# EAGLE schematic x9303 (EAGLE 9.6.2)

## Sheet 1 of 3
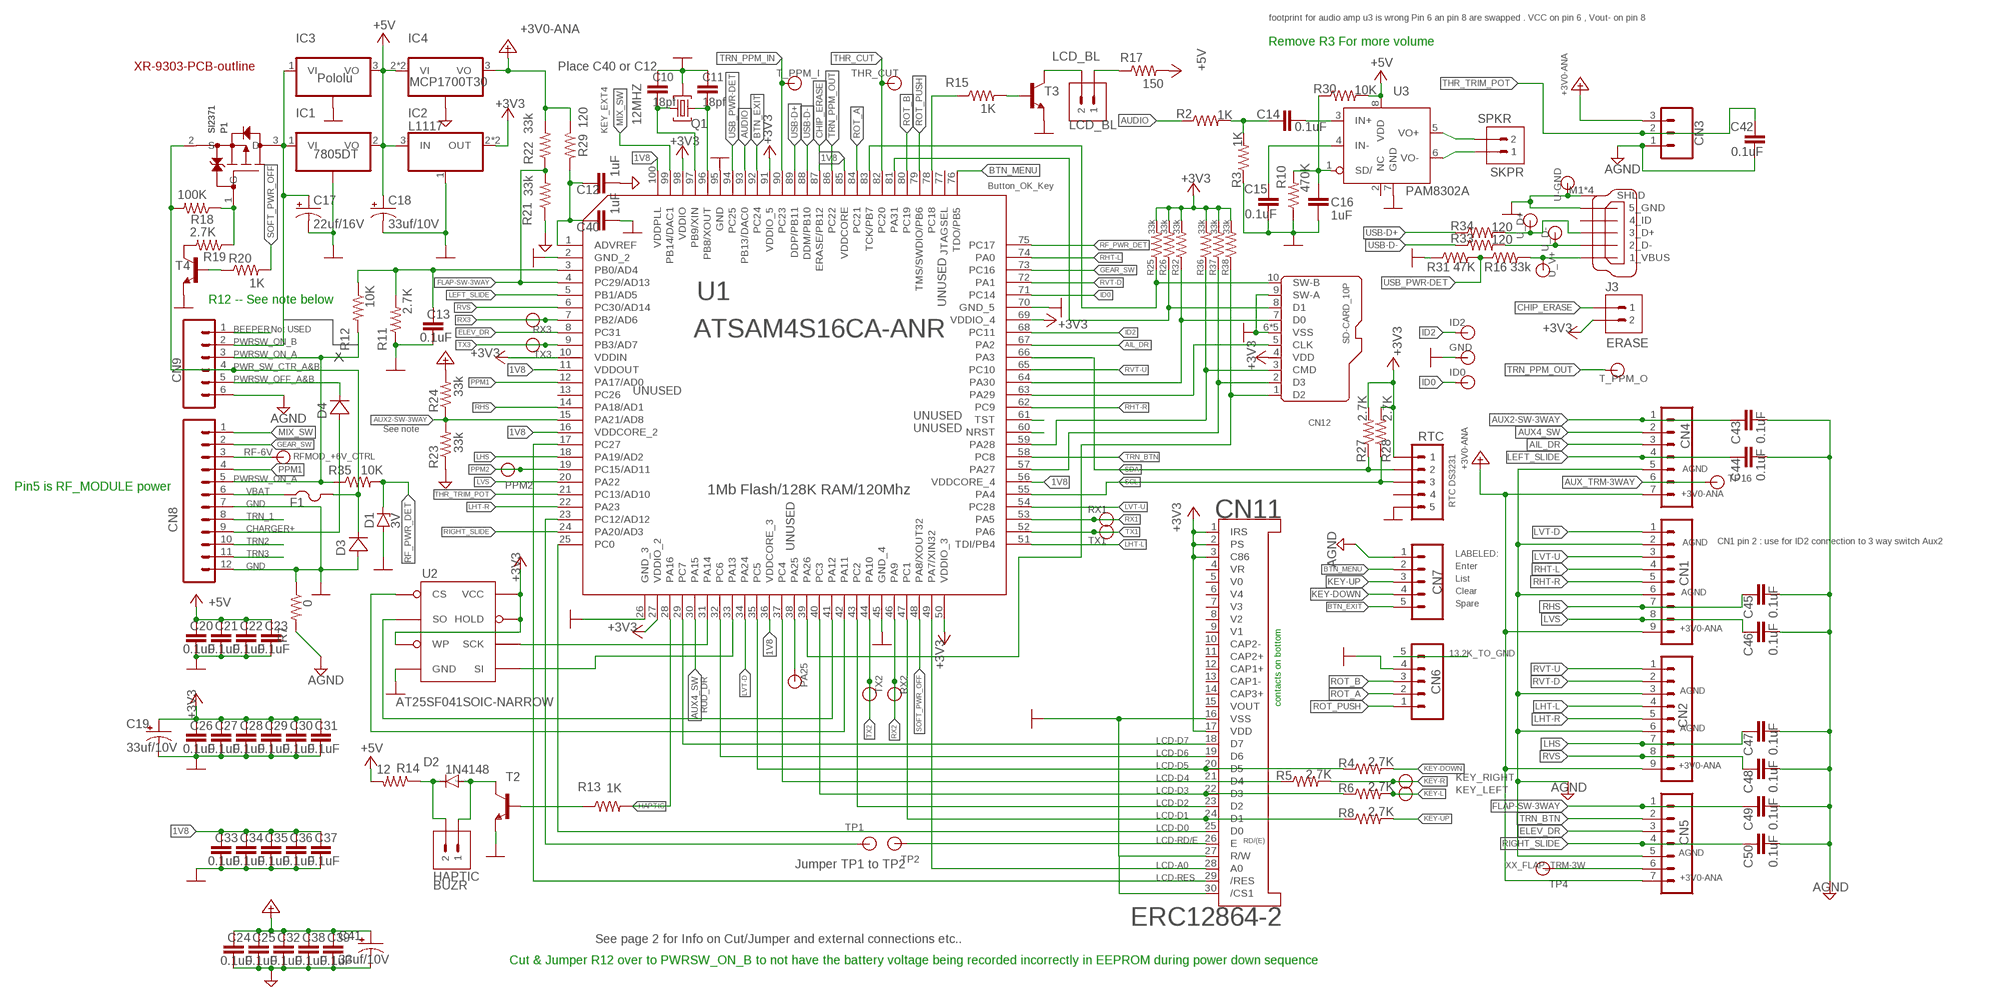
[diagram p0: schematic, sheet 1]

### Parts
BUZR  HAPTIC  M02  [1X02]
C10  18pf  C-EUC0603K  [C0603K]
C11  18pf  C-EUC0603K  [C0603K]
C12  1uF  C-EUC0603K  [C0603K]
C13  0.1uF  C-EUC0603K  [C0603K]
C14  0.1uF  C-EUC0603K  [C0603K]
C15  0.1uF  C-EUC0603K  [C0603K]
C16  1uF  C-EUC0603K  [C0603K]
C17  22uf/16V  CPOL-USSMCB  [SMC_B]
C18  33uf/10V  CPOL-USSMCB  [SMC_B]
C19  33uf/10V  CPOL-USSMCB  [SMC_B]
C20  0.1uF  C-EUC0603K  [C0603K]
C21  0.1uF  C-EUC0603K  [C0603K]
C22  0.1uF  C-EUC0603K  [C0603K]
C23  0.1uF  C-EUC0603K  [C0603K]
C24  0.1uF  C-EUC0603K  [C0603K]
C25  0.1uF  C-EUC0603K  [C0603K]
C26  0.1uF  C-EUC0603K  [C0603K]
C27  0.1uF  C-EUC0603K  [C0603K]
C28  0.1uF  C-EUC0603K  [C0603K]
C29  0.1uF  C-EUC0603K  [C0603K]
C30  0.1uF  C-EUC0603K  [C0603K]
C31  0.1uF  C-EUC0603K  [C0603K]
C32  0.1uF  C-EUC0603K  [C0603K]
C33  0.1uF  C-EUC0603K  [C0603K]
C34  0.1uF  C-EUC0603K  [C0603K]
C35  0.1uF  C-EUC0603K  [C0603K]
C36  0.1uF  C-EUC0603K  [C0603K]
C37  0.1uF  C-EUC0603K  [C0603K]
C38  0.1uF  C-EUC0603K  [C0603K]
C39  0.1uF  C-EUC0603K  [C0603K]
C40  1uF  C-EUC0603K  [C0603K]
C41  33uf/10V  CPOL-USSMCB  [SMC_B]
C42  0.1uF  C-EUC0603K  [C0603K]
C43  0.1uF  C-EUC0603K  [C0603K]
C44  0.1uF  C-EUC0603K  [C0603K]
C45  0.1uF  C-EUC0603K  [C0603K]
C46  0.1uF  C-EUC0603K  [C0603K]
C47  0.1uF  C-EUC0603K  [C0603K]
C48  0.1uF  C-EUC0603K  [C0603K]
C49  0.1uF  C-EUC0603K  [C0603K]
C50  0.1uF  C-EUC0603K  [C0603K]
CN1  CONN_09JST-9-PTH-V  [JST-9-PTH-VERT]
CN2  CONN_09JST-9-PTH-V  [JST-9-PTH-VERT]
CN3  CONN_03JST-PTH-VERT  [JST-3-PTH-VERT]
CN4  CONN_07JST-7PTH-V  [JST-7-PTH-VERT]
CN5  CONN_07JST-7PTH-V  [JST-7-PTH-VERT]
CN6  CONN_05JST-VERT  [JST-5-PTH-VERT]
CN7  CONN_05JST-VERT  [JST-5-PTH-VERT]
CN8  CONN_12JST-12-PTH-V  [JST-12-PTH-VERT]
CN9  CONN_06JST-6-PTH-V  [JST-6-PTH-VERT]
CN11  ERC12864-2  FPC_30_ERC12864-2  [FH12-30S-0.5SH]
CN12  SD-CARD_10P  [CONN8_DM3D-SF_HIR]
D1  3V  ZENER-DIODESOT23  [SOT23]
D2  1N4148  1N4148DO35-7  [DO35-7]
D3  MURA220T3G  [SMA]
D4  MURA220T3G  [SMA]
F1  SMD-FUSE-1206  [R1206]
GND  TP-1  [TP]
IC1  7805DT  [TO252]
IC2  L1117  REG1117  [SOT223]
IC3  Pololu  78  [POLOLU]
IC4  MCP1700T30  MCP1700  [SOT89]
ID0  TP-1  [TP]
ID2  TP-1  [TP]
J3  ERASE  M02  [1X02]
KEY_LEFT  TP-1  [TP]
KEY_RIGHT  TP-1  [TP]
LCD_BL  LCD_BL  M02  [1X02]
P1  SI2371  [SOT23]
PA25  TP-1  [TP]
PPM2  TP-1  [TP]
Q1  12MHZ  XTAL_SMD  [XTAL2.4X2.7]
R2  1K  R-US_R0603  [R0603]
R3  1K  R-US_R0603  [R0603]
R4  2.7K  R-US_R0603  [R0603]
R5  2.7K  R-US_R0603  [R0603]
R6  2.7K  R-US_R0603  [R0603]
R7  0  R-US_R0805  [R0805]
R8  2.7K  R-US_R0603  [R0603]
R10  470K  R-US_R0603  [R0603]
R11  2.7K  R-US_R0603  [R0603]
R12  10K  R-US_R0603  [R0603]
R13  1K  R-US_R0603  [R0603]
R14  12  R-US_R0805  [R0805]
R15  1K  R-US_R0603  [R0603]
R16  33k  R-US_R0603  [R0603]
R17  150  R-US_R0805  [R0805]
R18  100K  R-US_R0603  [R0603]
R19  2.7K  R-US_R0603  [R0603]
R20  1K  R-US_R0603  [R0603]
R21  33k  R-US_R0603  [R0603]
R22  33k  R-US_R0603  [R0603]
R23  33k  R-US_R0603  [R0603]
R24  33k  R-US_R0603  [R0603]
R25  33k  R-US_R0603  [R0603]
R26  33k  R-US_R0603  [R0603]
R27  2.7K  R-US_R0603  [R0603]
R28  2.7K  R-US_R0603  [R0603]
R29  120  R-US_R0603  [R0603]
R30  10K  R-US_R0603  [R0603]
R31  47K  R-US_R0603  [R0603]
R32  33k  R-US_R0603  [R0603]
R33  120  R-US_R0603  [R0603]
R34  120  R-US_R0603  [R0603]
R35  10K  R-US_R0603  [R0603]
R36  33k  R-US_R0603  [R0603]
R37  33k  R-US_R0603  [R0603]
R38  33k  R-US_R0603  [R0603]
RF-6V  TP-1  [TP]
RTC  M05PTH  [1X05]
RX1  TP-1  [TP]
RX2  TP-1  [TP]
RX3  TP-1  [TP]
SPKR  SKPR  M02  [1X02]
T2  MMBT3904  MMBT3904LT1-NPN-SOT23-BEC  [SOT23-BEC]
T3  MMBT3904  MMBT3904LT1-NPN-SOT23-BEC  [SOT23-BEC]
T4  MMBT3904  MMBT3904LT1-NPN-SOT23-BEC  [SOT23-BEC]
T_PPM_I  TP-1  [TP]
T_PPM_O  TP-1  [TP]
THR_CUT  TP-1  [TP]
TP1  TP-1  [TP]
TP2  TP-1  [TP]
TP4  TP-1  [TP]
TP16  TP-1  [TP]
TX1  TP-1  [TP]
TX2  TP-1  [TP]
TX3  TP-1  [TP]
U1  ATSAM4S16CA-ANR  [TQFP100_14X14MC_MCH]
U2  AT25SF041SOIC-NARROW  AT25F041SOIC-NARROW  [SO08]
U3  PAM8302A  [SOIC_2AADCR_DIO]
U$1  XR9303-PCB  [XR9303-PCB_OUTLINE]
U-GND  TP-1  [TP]
U_D+  TP-1  [TP]
U_D-  TP-1  [TP]
U_V+  TP-1  [TP]
X2  MINI-USB-32005-201  [32005-201]

### Nets
1V8: C33.2 C34.2 C35.2 C36.2 C37.2 U1.11(VDDOUT) U1.16(VDDCORE_2) U1.36(VDDCORE_3) U1.56(VDDCORE_4) U1.85(VDDCORE) U1.100(VDDPLL)
13.2K_TO_GND: CN6.5
+3V0-ANA: C24.2 C25.2 C32.2 C38.2 C39.2 C41.+ CN1.9 CN2.9 CN3.3 CN4.7 CN5.7 IC4.3(VO) R22.2 R24.2 R29.1
+3V3: C19.+ C26.2 C27.2 C28.2 C29.2 C30.2 C31.2 CN11.1(IRS) CN11.2(PS) CN11.3(C86) CN11.17(VDD) CN12.4(VDD) IC2.2(OUT) IC2.4(OUT) J3.2 R25.2 R26.2 R27.2 R28.2 R32.2 R36.2 R37.2 R38.2 RTC.1 U1.10(VDDIN) U1.27(VDDIO_2) U1.50(VDDIO_3) U1.69(VDDIO_4) U1.91(VDDIO_5) U1.98(VDDIO) U2.3(WP) U2.7(HOLD) U2.8(VCC)
+5V: C18.+ C20.2 C21.2 C22.2 C23.2 IC1.2(VO) IC2.3(IN) IC3.3(VO) IC4.2(VI) IC4.4(VI) R14.2 R17.2 R30.2 U3.8(VDD)
AGND: C12.2 C24.1 C25.1 C32.1 C38.1 C39.1 C41.- C42.1 C43.1 C44.1 C45.1 C46.1 C47.1 C48.1 C49.1 C50.1 CN1.2 CN1.6 CN2.3 CN2.6 CN3.1 CN4.5 CN5.5 CN7.1 CN9.6 IC4.1(GND) R7.2 R21.1 R23.1
AIL_DR: CN4.3 U1.67(PA2)
AUDIO: R2.1 U1.93(PB13/DAC0)
AUX2-SW-3WAY: C43.2 CN4.1 R23.2 R24.1 U1.15(PA21/AD8)
AUX4_SW: CN4.2 U1.30(PA15)
AUX_TRM-3WAY: CN4.6 TP16.P$1
BEEPER: CN9.1
BTN_EXIT: CN7.5 U1.92(PC24)
BTN_MENU: CN7.2 U1.76(TDO/PB5)
CHARGER+: CN8.9 D4.A
CHIP_ERASE: J3.1 U1.87(ERASE/PB12)
ELEV_DR: CN5.3 U1.8(PC31)
FLAP-SW-3WAY: C49.2 CN5.1 R21.2 R22.1 U1.4(PC29/AD13)
FLASH_CS: U1.42(PA11) U2.1(CS)
GEAR_SW: CN8.2 U1.73(PC16)
GND: C10.1 C11.1 C13.1 C15.1 C16.2 C17.- C18.- C19.- C20.1 C21.1 C22.1 C23.1 C26.1 C27.1 C28.1 C29.1 C30.1 C31.1 C33.1 C34.1 C35.1 C36.1 C37.1 C40.2 CN6.4 CN8.7 CN8.12 CN11.16(VSS) CN11.27(R/W) CN11.30(/CS1) CN12.6(VSS) CN12.9(SW-A) CN12.GND1(VSS) CN12.GND2(VSS) CN12.GND3(VSS) CN12.GND4(VSS) D1.1(A) D3.A GND.P$1 IC1.3(GND) IC2.1(GND) IC3.2(GND) Q1.P$2 Q1.P$4 R3.1 R7.1 R10.1 R11.1 R31.1 RTC.5 T2.E T3.E T4.E U1.2(GND_2) U1.26(GND_3) U1.45(GND_4) U1.70(GND_5) U1.95(GND) U2.4(GND) U3.7(GND) U-GND.P$1 X2.5_USB_GND(5_GND) X2.M1(SHLD) X2.M2(SHLD) X2.M3(SHLD) X2.M4(SHLD)
HAPTIC: R13.2 U1.28(PA16)
ID0: ID0.P$1 U1.71(PC14)
ID2: ID2.P$1 U1.68(PC11)
KEY-DOWN: CN7.4 R4.2
KEY-L: KEY_LEFT.P$1 R6.2
KEY-R: KEY_RIGHT.P$1 R5.2
KEY-UP: CN7.3 R8.2
LCD-A0: CN11.28(A0) U1.49(PA7/XIN32)
LCD-D0: CN11.25(D0) U1.25(PC0)
LCD-D1: CN11.24(D1) R8.1 U1.47(PC1)
LCD-D2: CN11.23(D2) U1.43(PC2)
LCD-D3: CN11.22(D3) R6.1 U1.40(PC3)
LCD-D4: CN11.21(D4) R5.1 U1.37(PC4)
LCD-D5: CN11.20(D5) R4.1 U1.35(PC5)
LCD-D6: CN11.19(D6) U1.32(PC6)
LCD-D7: CN11.18(D7) U1.29(PC7)
LCD-RD/E: CN11.26(E) TP2.P$1
LCD-RES: CN11.29(/RES) U1.17(PC27)
LCD_BL: R15.1 U1.78(PC18)
LEFT_SLIDE: C44.2 CN4.4 U1.5(PB1/AD5)
LHS: C47.2 CN2.7 U1.18(PA19/AD2)
LHT-L: CN2.4 U1.51(TDI/PB4)
LHT-R: CN2.5 U1.22(PA23)
LVS: C46.2 CN1.8 U1.20(PA22)
LVT-D: CN1.1 U1.34(PA24)
LVT-U: CN1.3 U1.54(PC28)
MIX_SW: CN8.1 U1.99(PB14/DAC1)
N$1: C16.1 R10.2 R30.1 U3.1(SD/)
N$2: R16.2 U_V+.P$1 X2.1_VBUS
N$13: P1.1(G) R18.1 R19.1
N$16: R19.2 T4.C
N$17: R34.2 U_D+.P$1 X2.3_D+
N$18: C14.1 R2.2 R3.2
N$19: R20.1 T4.B
N$20: BUZR.2 D2.C R14.1
N$22: TP1.P$1 U1.23(PC12/AD12)
N$23: U1.31(PA14) U2.6(SCK)
N$24: U1.33(PA13) U2.5(SI)
N$25: PA25.P$1 U1.38(PA25)
N$26: U1.41(PA12) U2.2(SO)
N$30: C10.2 Q1.P$3 U1.97(PB9/XIN)
N$31: C11.2 Q1.P$1 U1.96(PB8/XOUT)
N$34: CN12.8(D1) R26.1 U1.81(PA31)
N$35: CN12.10(SW-B) R25.1 U1.83(TCK/PB7)
N$36: CN12.7(D0) R32.1 U1.64(PA30)
N$37: CN12.5(CLK) U1.63(PA29)
N$38: R13.1 T2.B
N$40: CN12.2(D3) R37.1 U1.57(PA27)
N$41: CN12.1(D2) R38.1 U1.39(PA26)
N$42: SPKR.2 U3.5(VO+)
N$43: BUZR.1 D2.A T2.C
N$45: R15.2 T3.B
N$46: LCD_BL.2 T3.C
N$47: LCD_BL.1 R17.1
N$54: U1.61(TST)
N$55: U1.60(NRST)
N$57: C12.1 C40.1 R29.2 U1.1(ADVREF)
N$58: CN12.3(CMD) R36.1 U1.59(PA28)
N$59: SPKR.1 U3.6(VO-)
N$61: C14.2 U3.3(IN+)
N$62: C15.2 U3.4(IN-)
PPM1: CN8.4 U1.12(PA17/AD0)
PPM2: PPM2.P$1 U1.19(PC15/AD11)
PWR_SW_CTR_A&B: CN9.4 D3.C F1.2 P1.2(S) R18.2
PWRSW_OFF_A&B: CN9.5 D4.C
PWRSW_ON_A: CN8.5 CN9.3 R12.2 R35.1
PWRSW_ON_B: C17.+ CN9.2 IC1.1(VI) IC3.1(VI) P1.3(D)
RF_PWR_DET: D1.3(C) R35.2 U1.75(PC17)
RFMOD_+6V_CTRL: CN8.3 RF-6V.P$1
RHS: C45.2 CN1.7 U1.14(PA18/AD1)
RHT-L: CN1.4 U1.74(PA0)
RHT-R: CN1.5 U1.62(PC9)
RIGHT_SLIDE: C50.2 CN5.4 U1.24(PA20/AD3)
ROT_A: CN6.2 U1.84(PC21)
ROT_B: CN6.3 U1.80(PC19)
ROT_PUSH: CN6.1 U1.79(TMS/SWDIO/PB6)
RVS: C48.2 CN2.8 U1.6(PC30/AD14)
RVT-D: CN2.2 U1.72(PA1)
RVT-U: CN2.1 U1.65(PC10)
RX1: RX1.P$1 U1.53(PA5)
RX2: RX2.P$1 U1.46(PA9)
RX3: RX3.P$1 U1.7(PB2/AD6)
SCL: R28.1 RTC.3 U1.55(PA4)
SDA: R27.1 RTC.2 U1.66(PA3)
SOFT_PWR_OFF: R20.2 U1.48(PA8/XOUT32)
THR_CUT: THR_CUT.P$1 U1.82(PC20)
THR_TRIM_POT: C42.2 CN3.2 U1.21(PC13/AD10)
TRN2: CN8.10
TRN3: CN8.11
TRN_1: CN8.8
TRN_BTN: CN5.2 U1.58(PC8)
TRN_PPM_IN: T_PPM_I.P$1 U1.90(PC23)
TRN_PPM_OUT: T_PPM_O.P$1 U1.86(PC22)
TX1: TX1.P$1 U1.52(PA6)
TX2: TX2.P$1 U1.44(PA10)
TX3: TX3.P$1 U1.9(PB3/AD7)
USB-D+: R34.1 U1.89(DDP/PB11)
USB-D-: R33.1 U1.88(DDM/PB10)
USB_D-: R33.2 U_D-.P$1 X2.2_D-
USB_PWR-DET: R16.1 R31.2 U1.94(PC25)
VBAT: CN8.6 F1.1
VBAT_MEAS: C13.2 R11.2 R12.1 U1.3(PB0/AD4)
XX_FLAP_TRM-3W: CN5.6 TP4.P$1
Unconnected: CN11.4(VR) CN11.5(V0) CN11.6(V4) CN11.7(V3) CN11.8(V2) CN11.9(V1) CN11.10(CAP2-) CN11.11(CAP2+) CN11.12(CAP1+) CN11.13(CAP1-) CN11.14(CAP3+) CN11.15(VOUT) RTC.4 U1.13(PC26) U1.77(JTAGSEL) U3.2(NC) X2.4_ID

### Notes on the sheet
- footprint for audio amp u3 is wrong Pin 6 an pin 8 are swapped . VCC on pin 6 , Vout- on pin 8
- Remove R3 For more volume
- Place C40 or C12
- KEY_EXT4
- Button_OK_Key
- UNUSED
- R12 -- See note below
- Not USED
- PWRSW_ON_A
- UNUSED
- UNUSED
- See note | UNUSED
- Pin5 is RF_MODULE power
- 1Mb Flash/128K RAM/120Mhz
- RTC DS3231
- CN1 pin 2 : use for ID2 connection to 3 way switch Aux2
- UNUSED
- LABELED:
- Enter
- List
- Clear
- Spare
- contacts on bottom
- RUD_DR
- RD/(E)
- Jumper TP1 to TP2
- See page 2 for Info on Cut/Jumper and external connections etc..
- Cut & Jumper R12 over to PWRSW_ON_B to not have the battery voltage being recorded incorrectly in EEPROM during power down sequence

## Sheet 2 of 3
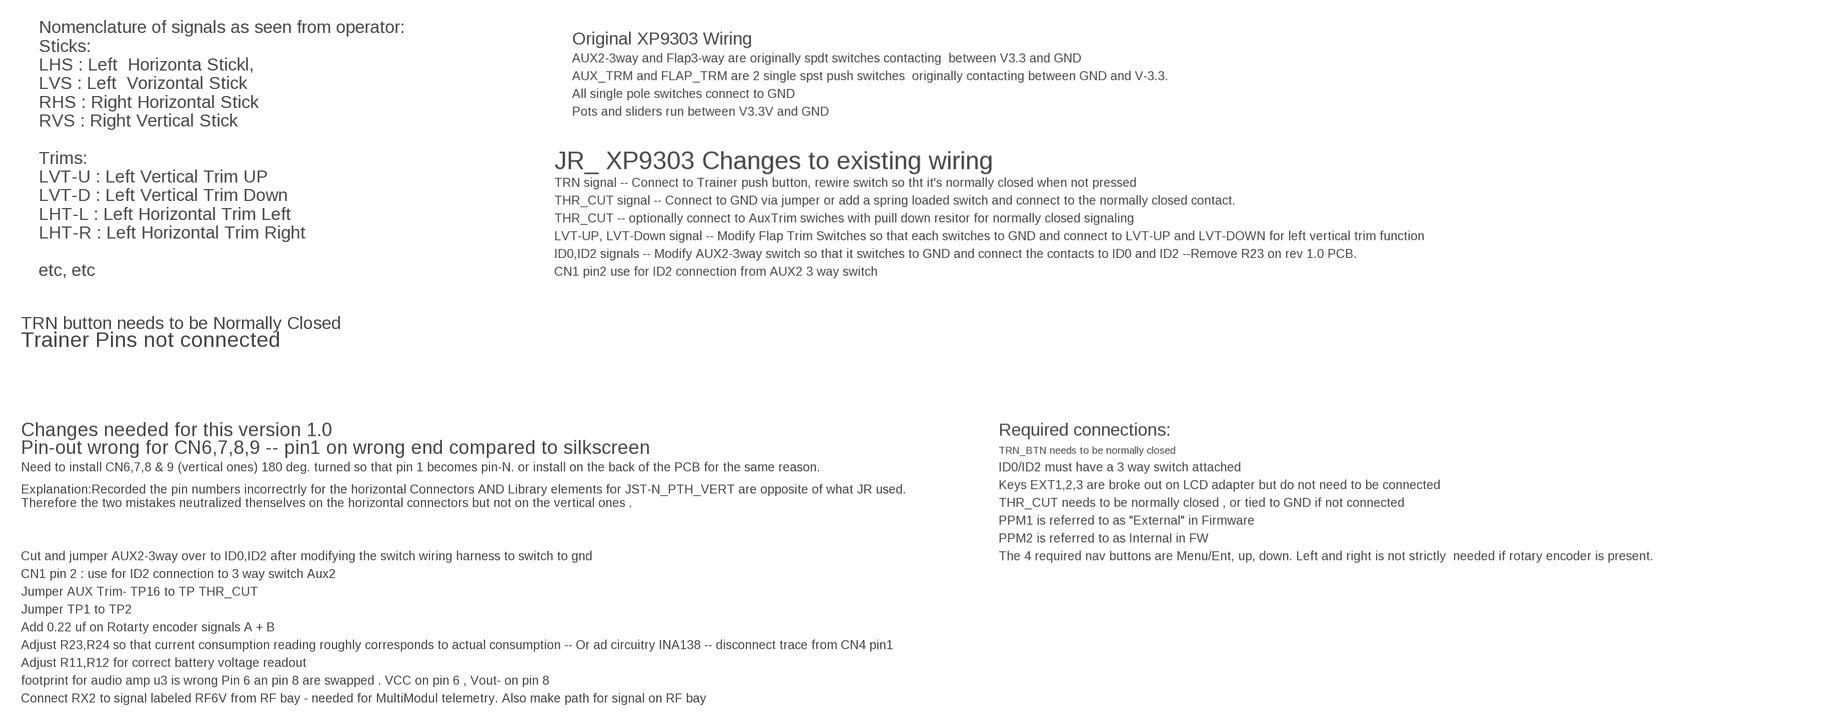
[diagram p1: schematic, sheet 2]

### Notes on the sheet
- Original XP9303 Wiring
- AUX2-3way and Flap3-way are originally spdt switches contacting  between V3.3 and GND
- AUX_TRM and FLAP_TRM are 2 single spst push switches  originally contacting between GND and V-3.3.
- All single pole switches connect to GND
- Pots and sliders run between V3.3V and GND
- JR_ XP9303 Changes to existing wiring
- TRN signal -- Connect to Trainer push button, rewire switch so tht it's normally closed when not pressed
- THR_CUT signal -- Connect to GND via jumper or add a spring loaded switch and connect to the normally closed contact.
- THR_CUT -- optionally connect to AuxTrim swiches with puill down resitor for normally closed signaling
- LVT-UP, LVT-Down signal -- Modify Flap Trim Switches so that each switches to GND and connect to LVT-UP and LVT-DOWN for left vertical trim function
- ID0,ID2 signals -- Modify AUX2-3way switch so that it switches to GND and connect the contacts to ID0 and ID2 --Remove R23 on rev 1.0 PCB.
- Nomenclature of signals as seen from operator:
  Sticks:
  LHS : Left  Horizonta Stickl,
  LVS : Left  Vorizontal Stick
  RHS : Right Horizontal Stick
  RVS : Right Vertical Stick
  
  Trims:
  LVT-U : Left Vertical Trim UP
  LVT-D : Left Vertical Trim Down
  LHT-L : Left Horizontal Trim Left
  LHT-R : Left Horizontal Trim Right
  
  etc, etc
- CN1 pin2 use for ID2 connection from AUX2 3 way switch
- TRN button needs to be Normally Closed
- Trainer Pins not connected
- Changes needed for this version 1.0 | Required connections:
- Pin-out wrong for CN6,7,8,9 -- pin1 on wrong end compared to silkscreen | TRN_BTN needs to be normally closed
- Need to install CN6,7,8 & 9 (vertical ones) 180 deg. turned so that pin 1 becomes pin-N. or install on the back of the PCB for the same reason. | ID0/ID2 must have a 3 way switch attached
- Keys EXT1,2,3 are broke out on LCD adapter but do not need to be connected
- Explanation:Recorded the pin numbers incorrectrly for the horizontal Connectors AND Library elements for JST-N_PTH_VERT are opposite of what JR used. 
  Therefore the two mistakes neutralized thenselves on the horizontal connectors but not on the vertical ones .
- THR_CUT needs to be normally closed , or tied to GND if not connected
- PPM1 is referred to as "External" in Firmware
- PPM2 is referred to as Internal in FW
- Cut and jumper AUX2-3way over to ID0,ID2 after modifying the switch wiring harness to switch to gnd | The 4 required nav buttons are Menu/Ent, up, down. Left and right is not strictly  needed if rotary encoder is present.
- CN1 pin 2 : use for ID2 connection to 3 way switch Aux2
- Jumper AUX Trim- TP16 to TP THR_CUT
- Jumper TP1 to TP2
- Add 0.22 uf on Rotarty encoder signals A + B
- Adjust R23,R24 so that current consumption reading roughly corresponds to actual consumption -- Or ad circuitry INA138 -- disconnect trace from CN4 pin1
- Adjust R11,R12 for correct battery voltage readout
- footprint for audio amp u3 is wrong Pin 6 an pin 8 are swapped . VCC on pin 6 , Vout- on pin 8
- Connect RX2 to signal labeled RF6V from RF bay - needed for MultiModul telemetry. Also make path for signal on RF bay

## Sheet 3 of 3
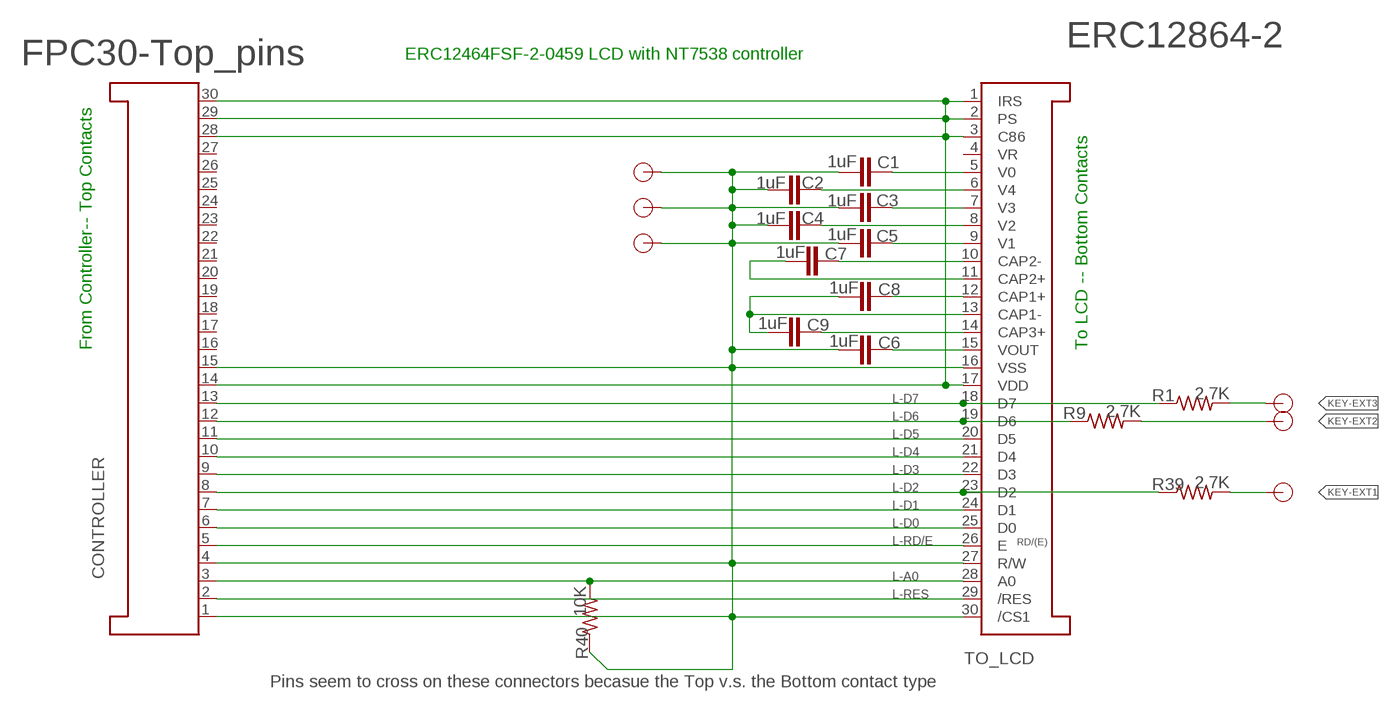
[diagram p2: schematic, sheet 3]

### Parts
C1  1uF  C-EUC0805  [C0805]
C2  1uF  C-EUC0805  [C0805]
C3  1uF  C-EUC0805  [C0805]
C4  1uF  C-EUC0805  [C0805]
C5  1uF  C-EUC0805  [C0805]
C6  1uF  C-EUC0805  [C0805]
C7  1uF  C-EUC0805  [C0805]
C8  1uF  C-EUC0805  [C0805]
C9  1uF  C-EUC0805  [C0805]
CONTROLLER  FPC30-Top_pins  FPC_30-PINS  [FH12-30S-0.5SH]
K1  TP-1  [TP]
K2  TP-1  [TP]
K3  TP-1  [TP]
K_EXT4  TP-1  [TP]
K_EXT5  TP-1  [TP]
K_EXT6  TP-1  [TP]
R1  2.7K  R-US_R0603  [R0603]
R9  2.7K  R-US_R0603  [R0603]
R39  2.7K  R-US_R0603  [R0603]
R40  10K  R-US_R0603  [R0603]
TO_LCD  ERC12864-2  FPC_30_ERC12864-2  [FH12-30S-0.5SH]

### Nets
KEY-EXT1: K1.P$1 R39.2
KEY-EXT2: K2.P$1 R9.2
KEY-EXT3: K3.P$1 R1.2
L-A0: CONTROLLER.3 R40.2 TO_LCD.28(A0)
L-D0: CONTROLLER.6 TO_LCD.25(D0)
L-D1: CONTROLLER.7 TO_LCD.24(D1)
L-D2: CONTROLLER.8 R39.1 TO_LCD.23(D2)
L-D3: CONTROLLER.9 TO_LCD.22(D3)
L-D4: CONTROLLER.10 TO_LCD.21(D4)
L-D5: CONTROLLER.11 TO_LCD.20(D5)
L-D6: CONTROLLER.12 R9.1 TO_LCD.19(D6)
L-D7: CONTROLLER.13 R1.1 TO_LCD.18(D7)
L-RD/E: CONTROLLER.5 TO_LCD.26(E)
L-RES: CONTROLLER.2 TO_LCD.29(/RES)
L_GND: C1.2 C2.2 C3.2 C4.2 C5.2 C6.2 CONTROLLER.1 CONTROLLER.4 CONTROLLER.15 K_EXT4.P$1 K_EXT5.P$1 K_EXT6.P$1 R40.1 TO_LCD.16(VSS) TO_LCD.27(R/W) TO_LCD.30(/CS1)
L_VDD: CONTROLLER.14 CONTROLLER.28 CONTROLLER.29 CONTROLLER.30 TO_LCD.1(IRS) TO_LCD.2(PS) TO_LCD.3(C86) TO_LCD.17(VDD)
N$3: C1.1 TO_LCD.5(V0)
N$4: C2.1 TO_LCD.6(V4)
N$5: C3.1 TO_LCD.7(V3)
N$6: C4.1 TO_LCD.8(V2)
N$7: C5.1 TO_LCD.9(V1)
N$9: C7.1 TO_LCD.10(CAP2-)
N$10: C7.2 TO_LCD.11(CAP2+)
N$11: C8.2 C9.2 TO_LCD.13(CAP1-)
N$12: C8.1 TO_LCD.12(CAP1+)
N$14: C9.1 TO_LCD.14(CAP3+)
N$15: C6.1 TO_LCD.15(VOUT)
Unconnected: CONTROLLER.16 CONTROLLER.17 CONTROLLER.18 CONTROLLER.19 CONTROLLER.20 CONTROLLER.21 CONTROLLER.22 CONTROLLER.23 CONTROLLER.24 CONTROLLER.25 CONTROLLER.26 CONTROLLER.27 TO_LCD.4(VR)

### Notes on the sheet
- ERC12464FSF-2-0459 LCD with NT7538 controller
- From Controller-- Top Contacts | To LCD -- Bottom Contacts
- RD/(E)
- Pins seem to cross on these connectors becasue the Top v.s. the Bottom contact type

## Library data of the parts
BUZR J3 LCD_BL SPKR = XP9300:M02
C1-C9 C12-C16 C20-C40 C42-C50 = rcl:C-EU: CAPACITOR, European symbol; SPICEPREFIX: C
C10 C11 = rcl:C-EU: CAPACITOR, European symbol; DIGIKEY: 1292-1494-1-ND; SPICEPREFIX: C
C17 = rcl:CPOL-US: POLARIZED CAPACITOR, American symbol; DIGIKEY: 478-1758-1-ND; SPICEPREFIX: C
C18 C19 C41 = rcl:CPOL-US: POLARIZED CAPACITOR, American symbol; DIGIKEY: 478-9074-1-ND; SPICEPREFIX: C
CN1 = XP9300:CONN_09: Multi connection point. Often used as Generic Header-pin footprint for 0.1 inch spaced/style header connections On any of the 0.1 inch spaced packages, you can populate with these: Break Away Headers - Straight <https://www.sparkfun.com/products/116> (PRT-00116) Break Away Male Headers - Right Angle <https://www.sparkfun.com/products/553> (PRT-00553) Female Headers <https://www.sparkfun.com/products/115> (PRT-00115) Break Away Headers - Machine Pin <https://www.sparkfun.com/products/117> (PRT-00117) Break Away Female Headers - Swiss Machine Pin <https://www.sparkfun.com/products/743> (PRT-00743) For SCREWTERMINALS and SPRING TERMINALS visit here: Screw Terimnals on SparkFun.com <https://www.sparkfun.com/search/results?term=Screw+Terminals> (5mm/3.5mm/2.54mm spacing) This device is also useful as a general connection point to wire up your design to another part of your project. Our various solder wires solder well into these plated through hole pads. Hook-Up Wire - Assortment (Stranded, 22 AWG) <https://www.sparkfun.com/products/11375> (PRT-11375) Hook-Up Wire - Assortment (Solid Core, 22 AWG) <https://www.sparkfun.com/products/11367> (PRT-11367) View the entire wire category on our website here <https://www.sparkfun.com/categories/141> Special notes: Molex polarized connector foot print use with SKU : PRT-08231 with associated crimp pins and housings. 1MM SMD Version SKU: PRT-10208 NOTES ON THE VARIANTS LOCK and LOCK_LONGPADS... This footprint was designed to help hold the alignment of a through-hole component (i.e. 6-pin header) while soldering it into place. You may notice that each hole has been shifted either up or down by 0.005 of an inch from it's more standard position (which is a perfectly straight line). This slight alteration caused the pins (the squares in the middle) to touch the edges of the holes. Because they are alternating, it causes a "brace" to hold the component in place. 0.005 has proven to be the perfect amount of "off-center" position when using our standard breakaway headers. Although looks a little odd when you look at the bare footprint, once you have a header in there, the alteration is very hard to notice. Also,if you push a header all the way into place, it is covered up entirely on the bottom side.
CN2 = XP9300:CONN_09: Multi connection point. Often used as Generic Header-pin footprint for 0.1 inch spaced/style header connections On any of the 0.1 inch spaced packages, you can populate with these: Break Away Headers - Straight <https://www.sparkfun.com/products/116> (PRT-00116) Break Away Male Headers - Right Angle <https://www.sparkfun.com/products/553> (PRT-00553) Female Headers <https://www.sparkfun.com/products/115> (PRT-00115) Break Away Headers - Machine Pin <https://www.sparkfun.com/products/117> (PRT-00117) Break Away Female Headers - Swiss Machine Pin <https://www.sparkfun.com/products/743> (PRT-00743) For SCREWTERMINALS and SPRING TERMINALS visit here: Screw Terimnals on SparkFun.com <https://www.sparkfun.com/search/results?term=Screw+Terminals> (5mm/3.5mm/2.54mm spacing) This device is also useful as a general connection point to wire up your design to another part of your project. Our various solder wires solder well into these plated through hole pads. Hook-Up Wire - Assortment (Stranded, 22 AWG) <https://www.sparkfun.com/products/11375> (PRT-11375) Hook-Up Wire - Assortment (Solid Core, 22 AWG) <https://www.sparkfun.com/products/11367> (PRT-11367) View the entire wire category on our website here <https://www.sparkfun.com/categories/141> Special notes: Molex polarized connector foot print use with SKU : PRT-08231 with associated crimp pins and housings. 1MM SMD Version SKU: PRT-10208 NOTES ON THE VARIANTS LOCK and LOCK_LONGPADS... This footprint was designed to help hold the alignment of a through-hole component (i.e. 6-pin header) while soldering it into place. You may notice that each hole has been shifted either up or down by 0.005 of an inch from it's more standard position (which is a perfectly straight line). This slight alteration caused the pins (the squares in the middle) to touch the edges of the holes. Because they are alternating, it causes a "brace" to hold the component in place. 0.005 has proven to be the perfect amount of "off-center" position when using our standard breakaway headers. Although looks a little odd when you look at the bare footprint, once you have a header in there, the alteration is very hard to notice. Also,if you push a header all the way into place, it is covered up entirely on the bottom side.; DIUGIKEY: A100041-nd
CN3 = XP9300:CONN_03: Multi connection point. Often used as Generic Header-pin footprint for 0.1 inch spaced/style header connections On any of the 0.1 inch spaced packages, you can populate with these: Break Away Headers - Straight <https://www.sparkfun.com/products/116> (PRT-00116) Break Away Male Headers - Right Angle <https://www.sparkfun.com/products/553> (PRT-00553) Female Headers <https://www.sparkfun.com/products/115> (PRT-00115) Break Away Headers - Machine Pin <https://www.sparkfun.com/products/117> (PRT-00117) Break Away Female Headers - Swiss Machine Pin <https://www.sparkfun.com/products/743> (PRT-00743) Stackable Header - 3 Pin (Female, 0.1") <https://www.sparkfun.com/products/13875> (PRT-13875) For SCREWTERMINALS and SPRING TERMINALS visit here: Screw Terimnals on SparkFun.com <https://www.sparkfun.com/search/results?term=Screw+Terminals> (5mm/3.5mm/2.54mm spacing) This device is also useful as a general connection point to wire up your design to another part of your project. Our various solder wires solder well into these plated through hole pads. Hook-Up Wire - Assortment (Stranded, 22 AWG) <https://www.sparkfun.com/products/11375> (PRT-11375) Hook-Up Wire - Assortment (Solid Core, 22 AWG) <https://www.sparkfun.com/products/11367> (PRT-11367) View the entire wire category on our website here <https://www.sparkfun.com/categories/141> Special notes: Molex polarized connector foot print use with SKU : PRT-08232 with associated crimp pins and housings.; DIGIKEY: swr201-nrtn-s03-sa-wh; PROD_ID: CONN-13230
CN4 = XP9300:CONN_07: Multi connection point. Often used as Generic Header-pin footprint for 0.1 inch spaced/style header connections On any of the 0.1 inch spaced packages, you can populate with these: Break Away Headers - Straight <https://www.sparkfun.com/products/116> (PRT-00116) Break Away Male Headers - Right Angle <https://www.sparkfun.com/products/553> (PRT-00553) Female Headers <https://www.sparkfun.com/products/115> (PRT-00115) Break Away Headers - Machine Pin <https://www.sparkfun.com/products/117> (PRT-00117) Break Away Female Headers - Swiss Machine Pin <https://www.sparkfun.com/products/743> (PRT-00743) For SCREWTERMINALS and SPRING TERMINALS visit here: Screw Terimnals on SparkFun.com <https://www.sparkfun.com/search/results?term=Screw+Terminals> (5mm/3.5mm/2.54mm spacing) This device is also useful as a general connection point to wire up your design to another part of your project. Our various solder wires solder well into these plated through hole pads. Hook-Up Wire - Assortment (Stranded, 22 AWG) <https://www.sparkfun.com/products/11375> (PRT-11375) Hook-Up Wire - Assortment (Solid Core, 22 AWG) <https://www.sparkfun.com/products/11367> (PRT-11367) View the entire wire category on our website here <https://www.sparkfun.com/categories/141> Special notes: Molex polarized connector foot print use with SKU : PRT-08231 with associated crimp pins and housings. 1MM SMD Version SKU: PRT-10208 NOTES ON THE VARIANTS LOCK and LOCK_LONGPADS... This footprint was designed to help hold the alignment of a through-hole component (i.e. 6-pin header) while soldering it into place. You may notice that each hole has been shifted either up or down by 0.005 of an inch from it's more standard position (which is a perfectly straight line). This slight alteration caused the pins (the squares in the middle) to touch the edges of the holes. Because they are alternating, it causes a "brace" to hold the component in place. 0.005 has proven to be the perfect amount of "off-center" position when using our standard breakaway headers. Although looks a little odd when you look at the bare footprint, once you have a header in there, the alteration is very hard to notice. Also,if you push a header all the way into place, it is covered up entirely on the bottom side.
CN5 = XP9300:CONN_07: Multi connection point. Often used as Generic Header-pin footprint for 0.1 inch spaced/style header connections On any of the 0.1 inch spaced packages, you can populate with these: Break Away Headers - Straight <https://www.sparkfun.com/products/116> (PRT-00116) Break Away Male Headers - Right Angle <https://www.sparkfun.com/products/553> (PRT-00553) Female Headers <https://www.sparkfun.com/products/115> (PRT-00115) Break Away Headers - Machine Pin <https://www.sparkfun.com/products/117> (PRT-00117) Break Away Female Headers - Swiss Machine Pin <https://www.sparkfun.com/products/743> (PRT-00743) For SCREWTERMINALS and SPRING TERMINALS visit here: Screw Terimnals on SparkFun.com <https://www.sparkfun.com/search/results?term=Screw+Terminals> (5mm/3.5mm/2.54mm spacing) This device is also useful as a general connection point to wire up your design to another part of your project. Our various solder wires solder well into these plated through hole pads. Hook-Up Wire - Assortment (Stranded, 22 AWG) <https://www.sparkfun.com/products/11375> (PRT-11375) Hook-Up Wire - Assortment (Solid Core, 22 AWG) <https://www.sparkfun.com/products/11367> (PRT-11367) View the entire wire category on our website here <https://www.sparkfun.com/categories/141> Special notes: Molex polarized connector foot print use with SKU : PRT-08231 with associated crimp pins and housings. 1MM SMD Version SKU: PRT-10208 NOTES ON THE VARIANTS LOCK and LOCK_LONGPADS... This footprint was designed to help hold the alignment of a through-hole component (i.e. 6-pin header) while soldering it into place. You may notice that each hole has been shifted either up or down by 0.005 of an inch from it's more standard position (which is a perfectly straight line). This slight alteration caused the pins (the squares in the middle) to touch the edges of the holes. Because they are alternating, it causes a "brace" to hold the component in place. 0.005 has proven to be the perfect amount of "off-center" position when using our standard breakaway headers. Although looks a little odd when you look at the bare footprint, once you have a header in there, the alteration is very hard to notice. Also,if you push a header all the way into place, it is covered up entirely on the bottom side.; DIGIKEY: 455-1709-ND
CN6 = XP9300:CONN_05: Multi connection point. Often used as Generic Header-pin footprint for 0.1 inch spaced/style header connections On any of the 0.1 inch spaced packages, you can populate with these: Break Away Headers - Straight <https://www.sparkfun.com/products/116> (PRT-00116) Break Away Male Headers - Right Angle <https://www.sparkfun.com/products/553> (PRT-00553) Female Headers <https://www.sparkfun.com/products/115> (PRT-00115) Break Away Headers - Machine Pin <https://www.sparkfun.com/products/117> (PRT-00117) Break Away Female Headers - Swiss Machine Pin <https://www.sparkfun.com/products/743> (PRT-00743) For SCREWTERMINALS and SPRING TERMINALS visit here: Screw Terimnals on SparkFun.com <https://www.sparkfun.com/search/results?term=Screw+Terminals> (5mm/3.5mm/2.54mm spacing) This device is also useful as a general connection point to wire up your design to another part of your project. Our various solder wires solder well into these plated through hole pads. Hook-Up Wire - Assortment (Stranded, 22 AWG) <https://www.sparkfun.com/products/11375> (PRT-11375) Hook-Up Wire - Assortment (Solid Core, 22 AWG) <https://www.sparkfun.com/products/11367> (PRT-11367) View the entire wire category on our website here <https://www.sparkfun.com/categories/141> Special notes: Molex polarized connector foot print use with SKU : PRT-08231 with associated crimp pins and housings. 1MM SMD Version SKU: PRT-10208; DIGIKEY: swr201-nrtn-s05-sa-wh
CN7 = XP9300:CONN_05: Multi connection point. Often used as Generic Header-pin footprint for 0.1 inch spaced/style header connections On any of the 0.1 inch spaced packages, you can populate with these: Break Away Headers - Straight <https://www.sparkfun.com/products/116> (PRT-00116) Break Away Male Headers - Right Angle <https://www.sparkfun.com/products/553> (PRT-00553) Female Headers <https://www.sparkfun.com/products/115> (PRT-00115) Break Away Headers - Machine Pin <https://www.sparkfun.com/products/117> (PRT-00117) Break Away Female Headers - Swiss Machine Pin <https://www.sparkfun.com/products/743> (PRT-00743) For SCREWTERMINALS and SPRING TERMINALS visit here: Screw Terimnals on SparkFun.com <https://www.sparkfun.com/search/results?term=Screw+Terminals> (5mm/3.5mm/2.54mm spacing) This device is also useful as a general connection point to wire up your design to another part of your project. Our various solder wires solder well into these plated through hole pads. Hook-Up Wire - Assortment (Stranded, 22 AWG) <https://www.sparkfun.com/products/11375> (PRT-11375) Hook-Up Wire - Assortment (Solid Core, 22 AWG) <https://www.sparkfun.com/products/11367> (PRT-11367) View the entire wire category on our website here <https://www.sparkfun.com/categories/141> Special notes: Molex polarized connector foot print use with SKU : PRT-08231 with associated crimp pins and housings. 1MM SMD Version SKU: PRT-10208
CN8 = XP9300:CONN_12: Multi connection point. Often used as Generic Header-pin footprint for 0.1 inch spaced/style header connections On any of the 0.1 inch spaced packages, you can populate with these: Break Away Headers - Straight <https://www.sparkfun.com/products/116> (PRT-00116) Break Away Male Headers - Right Angle <https://www.sparkfun.com/products/553> (PRT-00553) Female Headers <https://www.sparkfun.com/products/115> (PRT-00115) Break Away Headers - Machine Pin <https://www.sparkfun.com/products/117> (PRT-00117) Break Away Female Headers - Swiss Machine Pin <https://www.sparkfun.com/products/743> (PRT-00743) For SCREWTERMINALS and SPRING TERMINALS visit here: Screw Terimnals on SparkFun.com <https://www.sparkfun.com/search/results?term=Screw+Terminals> (5mm/3.5mm/2.54mm spacing) This device is also useful as a general connection point to wire up your design to another part of your project. Our various solder wires solder well into these plated through hole pads. Hook-Up Wire - Assortment (Stranded, 22 AWG) <https://www.sparkfun.com/products/11375> (PRT-11375) Hook-Up Wire - Assortment (Solid Core, 22 AWG) <https://www.sparkfun.com/products/11367> (PRT-11367) View the entire wire category on our website here <https://www.sparkfun.com/categories/141> Special notes: Molex polarized connector foot print use with SKU : PRT-08231 with associated crimp pins and housings. 1MM SMD Version SKU: PRT-10208 NOTES ON THE VARIANTS LOCK and LOCK_LONGPADS... This footprint was designed to help hold the alignment of a through-hole component (i.e. 6-pin header) while soldering it into place. You may notice that each hole has been shifted either up or down by 0.005 of an inch from it's more standard position (which is a perfectly straight line). This slight alteration caused the pins (the squares in the middle) to touch the edges of the holes. Because they are alternating, it causes a "brace" to hold the component in place. 0.005 has proven to be the perfect amount of "off-center" position when using our standard breakaway headers. Although looks a little odd when you look at the bare footprint, once you have a header in there, the alteration is very hard to notice. Also,if you push a header all the way into place, it is covered up entirely on the bottom side.; DIGIKEY: 415-1714-ND
CN9 = XP9300:CONN_06: Multi connection point. Often used as Generic Header-pin footprint for 0.1 inch spaced/style header connections On any of the 0.1 inch spaced packages, you can populate with these: Break Away Headers - Straight <https://www.sparkfun.com/products/116> (PRT-00116) Break Away Male Headers - Right Angle <https://www.sparkfun.com/products/553> (PRT-00553) Female Headers <https://www.sparkfun.com/products/115> (PRT-00115) Break Away Headers - Machine Pin <https://www.sparkfun.com/products/117> (PRT-00117) Break Away Female Headers - Swiss Machine Pin <https://www.sparkfun.com/products/743> (PRT-00743) Arduino Stackable Header - 6 Pin <https://www.sparkfun.com/products/9280> (PRT-09280) For SCREWTERMINALS and SPRING TERMINALS visit here: Screw Terimnals on SparkFun.com <https://www.sparkfun.com/search/results?term=Screw+Terminals> (5mm/3.5mm/2.54mm spacing) This device is also useful as a general connection point to wire up your design to another part of your project. Our various solder wires solder well into these plated through hole pads. Hook-Up Wire - Assortment (Stranded, 22 AWG) <https://www.sparkfun.com/products/11375> (PRT-11375) Hook-Up Wire - Assortment (Solid Core, 22 AWG) <https://www.sparkfun.com/products/11367> (PRT-11367) View the entire wire category on our website here <https://www.sparkfun.com/categories/141>; DIGIKEY: 455-1708-ND
CN11 = XP9300:FPC_30_ERC12864-2: 0.5mm Pitch Connectors For FPC/FFC Source: Data sheet <http://www.hirose.co.jp/cataloge_hp/e58605370.pdf>
CN12 = XP9300:SD-CARD_10P: Micro SD card holder with switch, Push/Pull; DIGIKEY: HR1941CT-ND
CONTROLLER = XP9300:FPC_30-PINS; DIGIKEY: 732-3517-ND
D1 = mydiode:ZENER-DIODE: Z-Diode; DIGIKEY: BZX84B3V0-FDICT-ND-Nd
D2 = mydiode:1N4148: DIODE high speed (Philips)
D3 D4 = XP9300:MURA220T3G: Surface Mount Schottky Power Rectifier Source: http://www.onsemi.com/pub_link/Collateral/MBRA340T3-D.PDF; DIGIKEY: MURA220T3GOSCT-ND
F1 = XP9300:SMD-FUSE: SMD Fuse Slow Blow; DIGIKEY: 118-SF-1206SP175L-2A9CT-ND
GND ID0 ID2 K1-K3 K_EXT4-K_EXT6 KEY_LEFT KEY_RIGHT PA25 PPM2 RF-6V RX1-RX3 T_PPM_I T_PPM_O THR_CUT TP1 TP2 TP4 TP16 TX1-TX3 U-GND U_D+ U_D- U_V+ = XP9300:TP-1
IC1 IC3 = XP9300:78*: Positive VOLTAGE REGULATOR Source: http://cache.national.com/ds/LM/LM78L05.pdf http://www.fairchildsemi.com/ds/LM/LM7805.pdf
IC2 = XP9300:REG1117: 800mA and 1A Low Dropout (LDO) Positive Regulator 1.8V, 2.5V, 2.85V, 3.3V, 5V, and Adj; DIGIKEY: 497-17239-1-ND
IC4 = XP9300:MCP1700; DIGIKEY: MCP1700T-3002MBCT-ND; VALUE: 3.0V
P1 = XP9300:SI2371: P-CH MOSFET , 30V, 4.8A, V-GS +-12V,
Q1 = XP9300:XTAL_SMD; DIGIKEY: lfxtal083388RL3K
R1-R40 = rcl:R-US_: RESISTOR, American symbol; SPICEPREFIX: R
RTC = XP9300:M05: Header 5 Standard 5-pin 0.1" header. Use with straight break away headers (SKU : PRT-00116), right angle break away headers (PRT-00553), swiss pins (PRT-00743), machine pins (PRT-00117), and female headers (PRT-00115). Molex polarized connector foot print use with SKU : PRT-08230 with associated crimp pins and housings.
T2-T4 = transistor:*-NPN-: NPN Transistror BF959 corrected 2008.03.06; DIGIKEY: 2368-MMBT3904-ND
TO_LCD = XP9300:FPC_30_ERC12864-2: 0.5mm Pitch Connectors For FPC/FFC Source: Data sheet <http://www.hirose.co.jp/cataloge_hp/e58605370.pdf>; DIGIKEY: 732-3518-ND
U1 = XP9300:ATSAM4S16CA-ANR: MicroChip/ATMEL uP 4S 1MB / 128KRam/ 120Mhz; DIGIKEY: 1611-ATSAM4S16CA-ANRCT-ND
U2 = XP9300:AT25F041: 4Mb SPI FLASH; DIGIKEY: AT25SF041B-SSHB-T
U3 = XP9300:PAM8302A: Mono audio amplifier; DIGIKEY: PAM8302AADCRDICT-ND
U$1 = XP9300:XR9303-PCB
X2 = XP9300:MINI-USB-: MINI USB-B Conector Source: www.cypressindustries.com